# Altium schematic sheet Memory Controller.SchDoc: DDR3L Memory Controller (HPS)
size A4; DrawnBy: Chris Segiet; Revision: v1.0.0
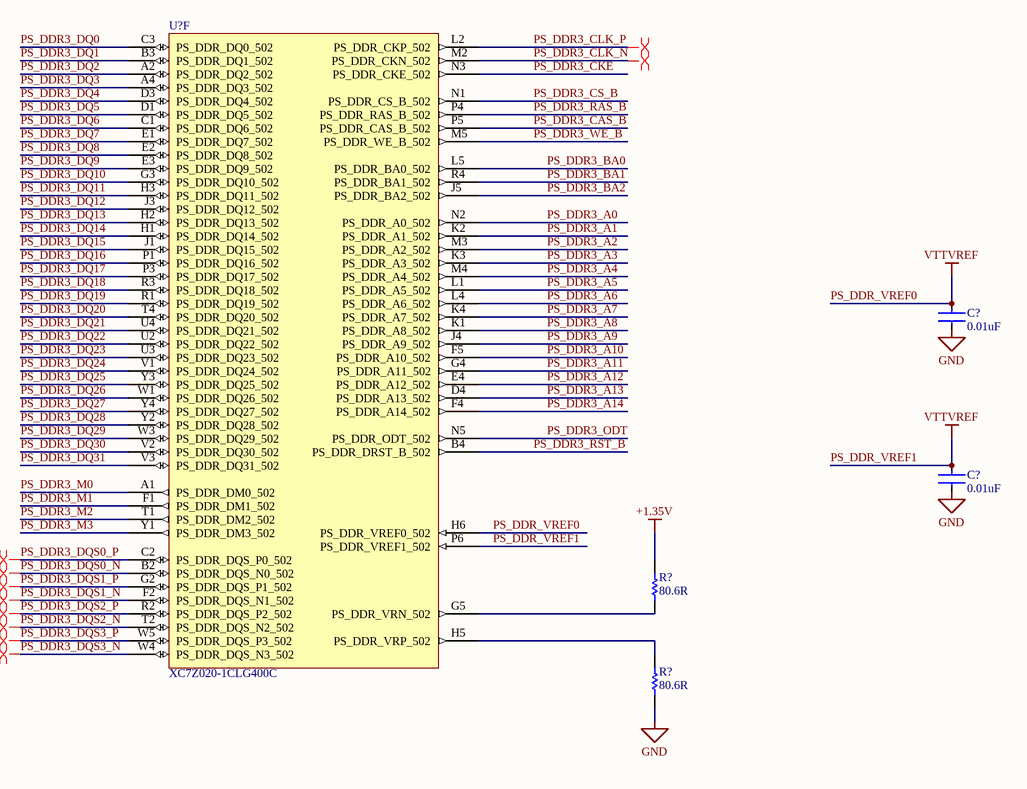
[diagram p0: Memory Controller.SchDoc]

## Parts
(Parts that share a designator on the sheet are numbered #1, #2 ... from top to bottom, then left to right.)
C?#1  0.01uF  [FP-C1005-050-0_05-IPC_B]
C?#2  0.01uF  [FP-C1005-050-0_05-IPC_B]
R?#1  80.6R  [RESC1005X40X25NL05T05]
R?#2  80.6R  [RESC1005X40X25NL05T05]
U?  XC7Z020-1CLG400C  [CLG400]  (part F of 9)

## Nets
+1.35V: R?#1.2
GND: C?#1.2 C?#2.2 R?#2.1
PS_DDR_VREF0: C?#1.1 C?#2.1 U?.H6(PS_DDR_VREF0_502) U?.P6(PS_DDR_VREF1_502)  [also labelled PS_DDR_VREF1, VTTVREF]
PS_DDR3_A0: U?.N2(PS_DDR_A0_502)
PS_DDR3_A1: U?.K2(PS_DDR_A1_502)
PS_DDR3_A2: U?.M3(PS_DDR_A2_502)
PS_DDR3_A3: U?.K3(PS_DDR_A3_502)
PS_DDR3_A4: U?.M4(PS_DDR_A4_502)
PS_DDR3_A5: U?.L1(PS_DDR_A5_502)
PS_DDR3_A6: U?.L4(PS_DDR_A6_502)
PS_DDR3_A7: U?.K4(PS_DDR_A7_502)
PS_DDR3_A8: U?.K1(PS_DDR_A8_502)
PS_DDR3_A9: U?.J4(PS_DDR_A9_502)
PS_DDR3_A10: U?.F5(PS_DDR_A10_502)
PS_DDR3_A11: U?.G4(PS_DDR_A11_502)
PS_DDR3_A12: U?.E4(PS_DDR_A12_502)
PS_DDR3_A13: U?.D4(PS_DDR_A13_502)
PS_DDR3_A14: U?.F4(PS_DDR_A14_502)
PS_DDR3_BA0: U?.L5(PS_DDR_BA0_502)
PS_DDR3_BA1: U?.R4(PS_DDR_BA1_502)
PS_DDR3_BA2: U?.J5(PS_DDR_BA2_502)
PS_DDR3_CAS_B: U?.P5(PS_DDR_CAS_B_502)
PS_DDR3_CKE: U?.N3(PS_DDR_CKE_502)
PS_DDR3_CLK_N: U?.M2(PS_DDR_CKN_502)
PS_DDR3_CLK_P: U?.L2(PS_DDR_CKP_502)
PS_DDR3_CS_B: U?.N1(PS_DDR_CS_B_502)
PS_DDR3_DQ0: U?.C3(PS_DDR_DQ0_502)
PS_DDR3_DQ1: U?.B3(PS_DDR_DQ1_502)
PS_DDR3_DQ2: U?.A2(PS_DDR_DQ2_502)
PS_DDR3_DQ3: U?.A4(PS_DDR_DQ3_502)
PS_DDR3_DQ4: U?.D3(PS_DDR_DQ4_502)
PS_DDR3_DQ5: U?.D1(PS_DDR_DQ5_502)
PS_DDR3_DQ6: U?.C1(PS_DDR_DQ6_502)
PS_DDR3_DQ7: U?.E1(PS_DDR_DQ7_502)
PS_DDR3_DQ8: U?.E2(PS_DDR_DQ8_502)
PS_DDR3_DQ9: U?.E3(PS_DDR_DQ9_502)
PS_DDR3_DQ10: U?.G3(PS_DDR_DQ10_502)
PS_DDR3_DQ11: U?.H3(PS_DDR_DQ11_502)
PS_DDR3_DQ12: U?.J3(PS_DDR_DQ12_502)
PS_DDR3_DQ13: U?.H2(PS_DDR_DQ13_502)
PS_DDR3_DQ14: U?.H1(PS_DDR_DQ14_502)
PS_DDR3_DQ15: U?.J1(PS_DDR_DQ15_502)
PS_DDR3_DQ16: U?.P1(PS_DDR_DQ16_502)
PS_DDR3_DQ17: U?.P3(PS_DDR_DQ17_502)
PS_DDR3_DQ18: U?.R3(PS_DDR_DQ18_502)
PS_DDR3_DQ19: U?.R1(PS_DDR_DQ19_502)
PS_DDR3_DQ20: U?.T4(PS_DDR_DQ20_502)
PS_DDR3_DQ21: U?.U4(PS_DDR_DQ21_502)
PS_DDR3_DQ22: U?.U2(PS_DDR_DQ22_502)
PS_DDR3_DQ23: U?.U3(PS_DDR_DQ23_502)
PS_DDR3_DQ24: U?.V1(PS_DDR_DQ24_502)
PS_DDR3_DQ25: U?.Y3(PS_DDR_DQ25_502)
PS_DDR3_DQ26: U?.W1(PS_DDR_DQ26_502)
PS_DDR3_DQ27: U?.Y4(PS_DDR_DQ27_502)
PS_DDR3_DQ28: U?.Y2(PS_DDR_DQ28_502)
PS_DDR3_DQ29: U?.W3(PS_DDR_DQ29_502)
PS_DDR3_DQ30: U?.V2(PS_DDR_DQ30_502)
PS_DDR3_DQ31: U?.V3(PS_DDR_DQ31_502)
PS_DDR3_DQS0_N: U?.B2(PS_DDR_DQS_N0_502)
PS_DDR3_DQS0_P: U?.C2(PS_DDR_DQS_P0_502)
PS_DDR3_DQS1_N: U?.F2(PS_DDR_DQS_N1_502)
PS_DDR3_DQS1_P: U?.G2(PS_DDR_DQS_P1_502)
PS_DDR3_DQS2_N: U?.T2(PS_DDR_DQS_N2_502)
PS_DDR3_DQS2_P: U?.R2(PS_DDR_DQS_P2_502)
PS_DDR3_DQS3_N: U?.W4(PS_DDR_DQS_N3_502)
PS_DDR3_DQS3_P: U?.W5(PS_DDR_DQS_P3_502)
PS_DDR3_M0: U?.A1(PS_DDR_DM0_502)
PS_DDR3_M1: U?.F1(PS_DDR_DM1_502)
PS_DDR3_M2: U?.T1(PS_DDR_DM2_502)
PS_DDR3_M3: U?.Y1(PS_DDR_DM3_502)
PS_DDR3_ODT: U?.N5(PS_DDR_ODT_502)
PS_DDR3_RAS_B: U?.P4(PS_DDR_RAS_B_502)
PS_DDR3_RST_B: U?.B4(PS_DDR_DRST_B_502)
PS_DDR3_WE_B: U?.M5(PS_DDR_WE_B_502)
NetR?#1_1: R?#1.1 U?.G5(PS_DDR_VRN_502)
NetR?#2_2: R?#2.2 U?.H5(PS_DDR_VRP_502)

## Layout directives
differential pair: PS_DDR3_CLK_N, PS_DDR3_CLK_P, PS_DDR3_DQS0_N, PS_DDR3_DQS0_P, PS_DDR3_DQS1_N, PS_DDR3_DQS1_P, PS_DDR3_DQS2_N, PS_DDR3_DQS2_P, PS_DDR3_DQS3_N, PS_DDR3_DQS3_P

## Notes on the sheet
- Title
- Size:
- Date:
- A3
- Drawn by:
- Time:
- Revision:
- Sheet
- of
- File:

## Library data of the parts
C?#1 C?#2 = CMP-08246-000726-2: Multilayer Ceramic Capacitors 10nF ±10% 25V X8R SMD 0402; Dissipation Factor: 3%; Length: 1mm; Capacitance: 10nF; Termination: SMD/SMT; Packaging: Tape and Reel; Weight: 2.3E-05oz; Resistor Type: Ceramic; Case/Package: 0402; Number of Pins: 2; Voltage Rating (DC): 25V; Voltage: 25V; Width: 0.02inch; Tolerance: 10%; Depth: 0.5mm; Case Code (Metric): 1005; Dielectric: X8R; RoHS Compliant: Yes; Max Operating Temperature: 150°C; Features: High Temperature; Voltage Rating: 25V; REACH SVHC: No SVHC; Series: C; Package Quantity: 10000; Mount: Surface Mount; Dielectric Material: Ceramic; Case Code (Imperial): 0402; Lead Free: Lead Free; Thickness: 0.022inch; Height: 0.5mm; Min Operating Temperature: -55°C
R?#1 R?#2 = CMP-2002-01076-1: 80.6 ohm 1% 0402; Manufacturer: Panasonic; Part Number: ERJ-2RKF80R6X
U? = CMP-0363-00002-3: 667 MHz Zynq™-7000 AP SoC, 130 PS I/O, 125 FPGA I/O, 400-Ball BGA, Speed Grade 1, Commercial Grade, Pb-Free; Flip Flops: 106400; Speed Grade: -1; LUTs: 53200; Extensible Block RAM (# 36Kb Blocks): 560 KB (140); PackageVersion: Rev 1.1, 09/2012; ComponentLink1Description: Datasheet; ComponentLink2Description: Package Specification; ComponentLink6Description: PCB and Layout Guide; PackageDescription: Wire-Bond Chip-Scale BGA, Body 17 x 17 mm, 0.8 mm Pitch; RoHS: Pb-Free; DatasheetVersion: v1.2; Mounting Technology: Surface Mount; ComponentLink5Description: Packaging and Pinout; ComponentLink5URL: http://www.xilinx.com/support/documentation/user_guides/ug865-Zynq-7000-Pkg-Pinout.pdf; ComponentLink6URL: http://www.xilinx.com/support/documentation/user_guides/ug483_7Series_PCB.pdf; Generic Part Number: XC7Z020; ComponentLink3Description: DC and AC Switching Characteristics; ComponentLink2URL: http://www.xilinx.com/support/documentation/user_guides/ug865-Zynq-7000-Pkg-Pinout.pdf; ComponentLink4Description: Package File; ComponentLink1URL: http://www.xilinx.com/support/documentation/data_sheets/ds190-Zynq-7000-Overview.pdf; PackageReference: CLG400; ComponentLink3URL: http://www.xilinx.com/support/documentation/data_sheets/ds187-XC7Z010-XC7Z020-Data-Sheet.pdf; PartNumber: XC7Z020-1CLG400C; ComponentLink4URL: http://www.xilinx.com/support/packagefiles/z7packages/xc7z020clg400pkg.txt; Code_JEDEC: MO-275-MMAA-1